# EAGLE schematic mcp23s17_grundschaltung (EAGLE 8.2.1)
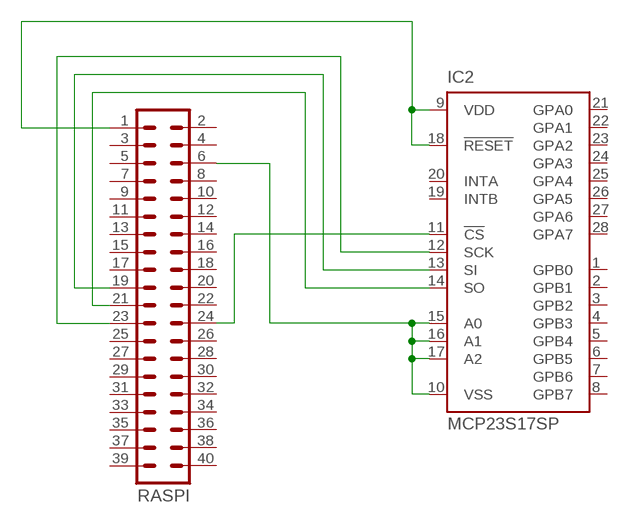
[diagram p0: schematic, sheet 1]

## Parts
IC2  MCP23S17SP  [DIL28-3]
RASPI  ML40  [ML40]

## Nets
N$3: IC2.14(SO) RASPI.21
N$4: IC2.13(SI) RASPI.19
N$5: IC2.9(VDD) IC2.18(!RESET) RASPI.1
N$18: IC2.10(VSS) IC2.15(A0) IC2.16(A1) IC2.17(A2) RASPI.6
N$22: IC2.12(SCK) RASPI.23
N$24: IC2.11(!CS) RASPI.24
Unconnected: IC2.1(GPB0) IC2.2(GPB1) IC2.3(GPB2) IC2.4(GPB3) IC2.5(GPB4) IC2.6(GPB5) IC2.7(GPB6) IC2.8(GPB7) IC2.19(INTB) IC2.20(INTA) IC2.21(GPA0) IC2.22(GPA1) IC2.23(GPA2) IC2.24(GPA3) IC2.25(GPA4) IC2.26(GPA5) IC2.27(GPA6) IC2.28(GPA7) RASPI.2 RASPI.3 RASPI.4 RASPI.5 RASPI.7 RASPI.8 RASPI.9 RASPI.10 RASPI.11 RASPI.12 RASPI.13 RASPI.14 RASPI.15 RASPI.16 RASPI.17 RASPI.18 RASPI.20 RASPI.22 RASPI.25 RASPI.26 RASPI.27 RASPI.28 RASPI.29 RASPI.30 RASPI.31 RASPI.32 RASPI.33 RASPI.34 RASPI.35 RASPI.36 RASPI.37 RASPI.38 RASPI.39 RASPI.40

## Library data of the parts
IC2 = microchip:MCP23S17: http://ww1.microchip.com/downloads/en/DeviceDoc/21952a.pdf Source: http://ww1.microchip.com/downloads/en/DeviceDoc/21952a.pdf; MF: MICROCHIP; MPN: MCP23S17-E/SP; OC_FARNELL: 1292238; OC_NEWARK: 31K2951
RASPI = con-ml:ML40: HARTING; OC_FARNELL: unknown; OC_NEWARK: unknown